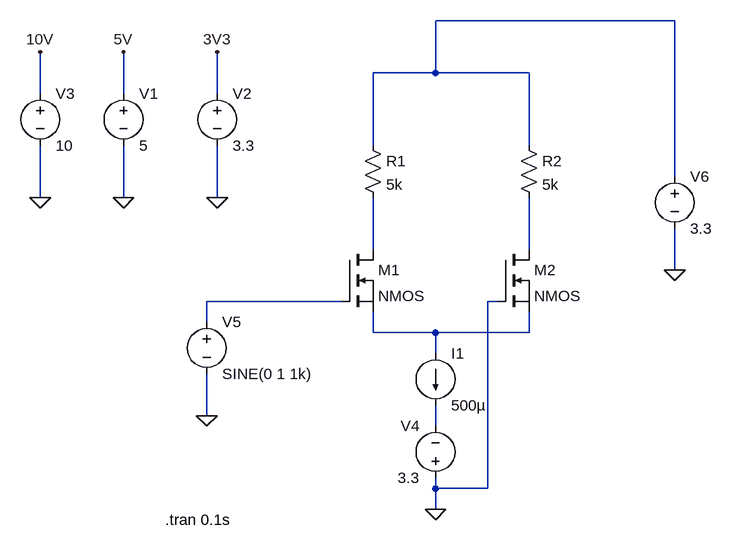
[diagram p0: schematic Differential Amp.asc]
Differential Amp.asc, the LTspice schematic file:
Version 4
SHEET 1 1056 800
WIRE 992 16 624 16
WIRE 624 96 624 16
WIRE 624 96 528 96
WIRE 768 96 624 96
WIRE 16 128 16 64
WIRE 144 128 144 64
WIRE 288 128 288 64
WIRE 528 208 528 96
WIRE 768 208 768 96
WIRE 992 256 992 16
WIRE 16 288 16 208
WIRE 144 288 144 208
WIRE 288 288 288 208
WIRE 528 368 528 288
WIRE 768 368 768 288
WIRE 992 400 992 336
WIRE 480 448 272 448
WIRE 720 448 704 448
WIRE 272 480 272 448
WIRE 528 496 528 464
WIRE 624 496 528 496
WIRE 768 496 768 464
WIRE 768 496 624 496
WIRE 624 528 624 496
WIRE 272 624 272 560
WIRE 624 640 624 608
WIRE 624 736 624 720
WIRE 704 736 704 448
WIRE 704 736 624 736
WIRE 624 768 624 736
FLAG 144 288 0
FLAG 144 64 5V
FLAG 288 288 0
FLAG 288 64 3V3
FLAG 16 288 0
FLAG 16 64 10V
FLAG 624 768 0
FLAG 272 624 0
FLAG 992 400 0
SYMBOL voltage 144 112 R0
SYMATTR InstName V1
SYMATTR Value 5
SYMBOL voltage 288 112 R0
SYMATTR InstName V2
SYMATTR Value 3.3
SYMBOL voltage 16 112 R0
SYMATTR InstName V3
SYMATTR Value 10
SYMBOL nmos 480 368 R0
SYMATTR InstName M1
SYMBOL nmos 720 368 R0
SYMATTR InstName M2
SYMBOL current 624 528 R0
SYMATTR InstName I1
SYMATTR Value 500µ
SYMBOL voltage 624 736 R180
WINDOW 0 24 96 Left 2
WINDOW 3 24 16 Left 2
SYMATTR InstName V4
SYMATTR Value 3.3
SYMBOL voltage 272 464 R0
WINDOW 123 0 0 Left 0
WINDOW 39 0 0 Left 0
SYMATTR InstName V5
SYMATTR Value SINE(0 1 1k)
SYMBOL res 512 192 R0
SYMATTR InstName R1
SYMATTR Value 5k
SYMBOL res 752 192 R0
SYMATTR InstName R2
SYMATTR Value 5k
SYMBOL voltage 992 240 R0
SYMATTR InstName V6
SYMATTR Value 3.3
TEXT 208 784 Left 2 !.tran 0.1s

The netlist it stands for:
* Differential Amp.asc
V1 5V 0 5
V2 3V3 0 3.3
V3 10V 0 10
M1 N002 N004 N005 N005 NMOS
M2 N003 0 N005 N005 NMOS
I1 N005 N006 500µ
V4 0 N006 3.3
V5 N004 0 SINE(0 1 1k)
R1 N001 N002 5k
R2 N001 N003 5k
V6 N001 0 3.3
.model NMOS NMOS
.model PMOS PMOS
.lib standard.mos
.tran 0.1s
.backanno
.end